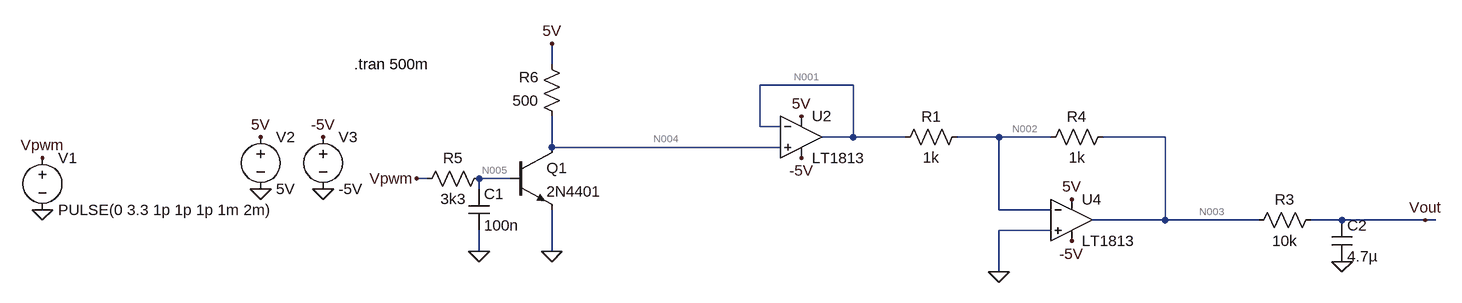
[diagram p0: schematic ContrastValue.asc]
ContrastValue.asc, the LTspice schematic file:
Version 4
SHEET 1 1924 680
WIRE 368 -192 368 -224
WIRE 832 -160 688 -160
WIRE 688 -96 688 -160
WIRE 720 -96 688 -96
WIRE 832 -80 832 -160
WIRE 832 -80 784 -80
WIRE 912 -80 832 -80
WIRE 1056 -80 992 -80
WIRE 1136 -80 1056 -80
WIRE 1312 -80 1216 -80
WIRE 368 -64 368 -112
WIRE 720 -64 368 -64
WIRE 176 -16 160 -16
WIRE 304 -16 256 -16
WIRE 256 0 256 -16
WIRE 1056 32 1056 -80
WIRE 1136 32 1056 32
WIRE 1312 48 1312 -80
WIRE 1312 48 1200 48
WIRE 1456 48 1312 48
WIRE 1584 48 1536 48
WIRE 1712 48 1584 48
WIRE 1728 48 1712 48
WIRE 1136 64 1056 64
WIRE 256 96 256 64
WIRE 368 96 368 32
WIRE 1056 128 1056 64
FLAG -416 -48 Vpwm
FLAG -416 32 0
FLAG -80 0 0
FLAG -80 -80 5V
FLAG 752 -112 5V
FLAG 1056 128 0
FLAG 16 -80 -5V
FLAG 16 0 0
FLAG 1168 16 5V
FLAG 752 -48 -5V
FLAG 1168 80 -5V
FLAG 160 -16 Vpwm
FLAG 1584 112 0
FLAG 1712 48 Vout
FLAG 368 96 0
FLAG 368 -224 5V
FLAG 256 96 0
SYMBOL voltage -416 -64 R0
WINDOW 123 0 0 Left 2
WINDOW 39 0 0 Left 2
SYMATTR InstName V1
SYMATTR Value PULSE(0 3.3 1p 1p 1p 1m 2m)
SYMBOL voltage -80 -96 R0
WINDOW 123 0 0 Left 2
WINDOW 39 0 0 Left 2
SYMATTR InstName V2
SYMATTR Value 5V
SYMBOL res 1008 -96 R90
WINDOW 0 0 56 VBottom 2
WINDOW 3 32 56 VTop 2
SYMATTR InstName R1
SYMATTR Value 1k
SYMBOL res 1232 -96 R90
WINDOW 0 0 56 VBottom 2
WINDOW 3 32 56 VTop 2
SYMATTR InstName R4
SYMATTR Value 1k
SYMBOL voltage 16 -96 R0
WINDOW 123 0 0 Left 2
WINDOW 39 0 0 Left 2
SYMATTR InstName V3
SYMATTR Value -5V
SYMBOL res 1552 32 R90
WINDOW 0 0 56 VBottom 2
WINDOW 3 32 56 VTop 2
SYMATTR InstName R3
SYMATTR Value 10k
SYMBOL cap 1568 48 R0
SYMATTR InstName C2
SYMATTR Value 4.7µ
SYMBOL res 272 -32 R90
WINDOW 0 0 56 VBottom 2
WINDOW 3 32 56 VTop 2
SYMATTR InstName R5
SYMATTR Value 3k3
SYMBOL res 384 -96 R180
WINDOW 0 36 76 Left 2
WINDOW 3 36 40 Left 2
SYMATTR InstName R6
SYMATTR Value 500
SYMBOL npn 304 -64 R0
SYMATTR InstName Q1
SYMATTR Value 2N4401
SYMBOL Opamps\\LT1813 752 -144 R0
SYMATTR InstName U2
SYMBOL Opamps\\LT1813 1168 -16 R0
SYMATTR InstName U4
SYMBOL cap 240 0 R0
SYMATTR InstName C1
SYMATTR Value 100n
TEXT 64 -192 Left 2 !.tran 500m

The netlist it stands for:
* ContrastValue.asc
V1 Vpwm 0 PULSE(0 3.3 1p 1p 1p 1m 2m)
V2 5V 0 5V
R1 N002 N001 1k
R4 N003 N002 1k
V3 -5V 0 -5V
R3 Vout N003 10k
C2 Vout 0 4.7µ
R5 N005 Vpwm 3k3
R6 N004 5V 500
Q1 N004 N005 0 0 2N4401
XU2 N004 N001 5V -5V N001 LT1813  ; pins In+ In- V+ V- OUT
XU4 0 N002 5V -5V N003 LT1813  ; pins In+ In- V+ V- OUT
C1 N005 0 100n
.model NPN NPN
.model PNP PNP
.lib standard.bjt
.tran 500m
.lib LTC.lib
.backanno
.end

* Results of the author's LTspice run, read from the files saved beside the schematic
* Operating Point, zero values left out:
*   V(5v) = 5 V
*   V(n002) = 6.225 mV
*   V(n001) = 4.049 V
*   V(n003) = -4.037 V
*   V(-5v) = -5 V
*   V(vout) = -4.037 V
*   V(n005) = 16.58 nV
*   V(n004) = 4.999 V
*   Ic(Q1) = 5.052 pA
*   Ib(Q1) = -5.025 pA
*   I(R6) = -1.094 µA
*   I(R5) = 5.025 pA
*   I(R4) = -4.043 mA
*   I(R1) = -4.042 mA
*   I(V3) = 7.007 mA
*   I(V2) = -7.008 mA
*   I(V1) = 5.025 pA
*   Ix(u2:1) = 1.094 µA
*   Ix(u2:2) = -1.089 µA
*   Ix(u2:3) = 5.523 mA
*   Ix(u2:4) = -1.482 mA
*   Ix(u2:5) = -4.041 mA
*   Ix(u4:1) = -904.5 nA
*   Ix(u4:2) = -896.1 nA
*   Ix(u4:3) = 1.483 mA
*   Ix(u4:4) = -5.524 mA
*   Ix(u4:5) = 4.043 mA